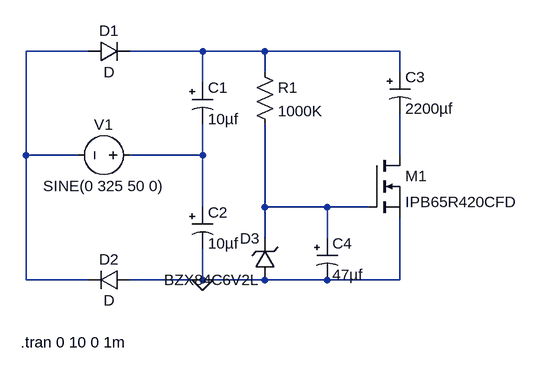
[diagram p0: schematic fullwave-doubler-1V02.asc]
fullwave-doubler-1V02.asc, the LTspice schematic file:
Version 4
SHEET 1 880 680
WIRE -144 -144 -240 -144
WIRE 32 -144 -80 -144
WIRE 128 -144 32 -144
WIRE 336 -144 128 -144
WIRE 128 -112 128 -144
WIRE 336 -112 336 -144
WIRE 32 -96 32 -144
WIRE -240 16 -240 -144
WIRE -160 16 -240 16
WIRE 32 16 32 -32
WIRE 32 16 -80 16
WIRE 336 16 336 -48
WIRE 32 96 32 16
WIRE 128 96 128 -32
WIRE 224 96 128 96
WIRE 288 96 224 96
WIRE 128 144 128 96
WIRE 224 144 224 96
WIRE -240 208 -240 16
WIRE -144 208 -240 208
WIRE 32 208 32 160
WIRE 32 208 -80 208
WIRE 128 208 32 208
WIRE 224 208 128 208
WIRE 336 208 336 112
WIRE 336 208 224 208
FLAG 32 208 0
SYMBOL voltage -64 16 R90
WINDOW 0 -32 56 VBottom 2
WINDOW 3 32 56 VTop 2
WINDOW 123 0 0 Left 2
WINDOW 39 0 0 Left 2
SYMATTR InstName V1
SYMATTR Value SINE(0 325 50 0)
SYMBOL polcap 16 -96 R0
SYMATTR InstName C1
SYMATTR Value 10µf
SYMATTR Description Capacitor
SYMATTR Type cap
SYMATTR SpiceLine V=6.3 Irms=34m Rser=1.3 Lser=0
SYMBOL nmos 288 16 R0
SYMATTR InstName M1
SYMATTR Value IPB65R420CFD
SYMBOL diode -144 -128 R270
WINDOW 0 32 32 VTop 2
WINDOW 3 0 32 VBottom 2
SYMATTR InstName D1
SYMBOL diode -80 192 R90
WINDOW 0 0 32 VBottom 2
WINDOW 3 32 32 VTop 2
SYMATTR InstName D2
SYMBOL polcap 16 96 R0
SYMATTR InstName C2
SYMATTR Value 10µf
SYMATTR Description Capacitor
SYMATTR Type cap
SYMATTR SpiceLine V=6.3 Irms=34m Rser=1.3 Lser=0
SYMBOL polcap 320 -112 R0
SYMATTR InstName C3
SYMATTR Value 2200µf
SYMATTR Description Capacitor
SYMATTR Type cap
SYMATTR SpiceLine V=6.3 Irms=34m Rser=100m Lser=0
SYMBOL polcap 208 144 R0
SYMATTR InstName C4
SYMATTR Value 47µf
SYMATTR Description Capacitor
SYMATTR Type cap
SYMATTR SpiceLine V=6.3 Irms=34m Rser=2.4 Lser=0
SYMBOL res 112 -128 R0
SYMATTR InstName R1
SYMATTR Value 1000K
SYMBOL zener 144 208 R180
WINDOW 0 24 64 Left 2
WINDOW 3 24 0 Left 2
SYMATTR InstName D3
SYMATTR Value BZX84C6V2L
SYMATTR Description Diode
SYMATTR Type diode
TEXT -248 304 Left 2 !.tran 0 10 0 1m

The netlist it stands for:
* fullwave-doubler-1V02.asc
V1 N003 N001 SINE(0 325 50 0)
C1 N002 N003 10µf V=6.3 Irms=34m Rser=1.3 Lser=0
M1 N004 N005 0 0 IPB65R420CFD
D1 N001 N002 D
D2 0 N001 D
C2 N003 0 10µf V=6.3 Irms=34m Rser=1.3 Lser=0
C3 N002 N004 2200µf V=6.3 Irms=34m Rser=100m Lser=0
C4 N005 0 47µf V=6.3 Irms=34m Rser=2.4 Lser=0
R1 N002 N005 1000K
D3 0 N005 BZX84C6V2L
.model D D
.lib standard.dio
.model NMOS NMOS
.model PMOS PMOS
.lib standard.mos
.tran 0 10 0 1m
.backanno
.end